# EAGLE schematic 07D-010 (EAGLE 6.3)

## Sheet 1 of 2
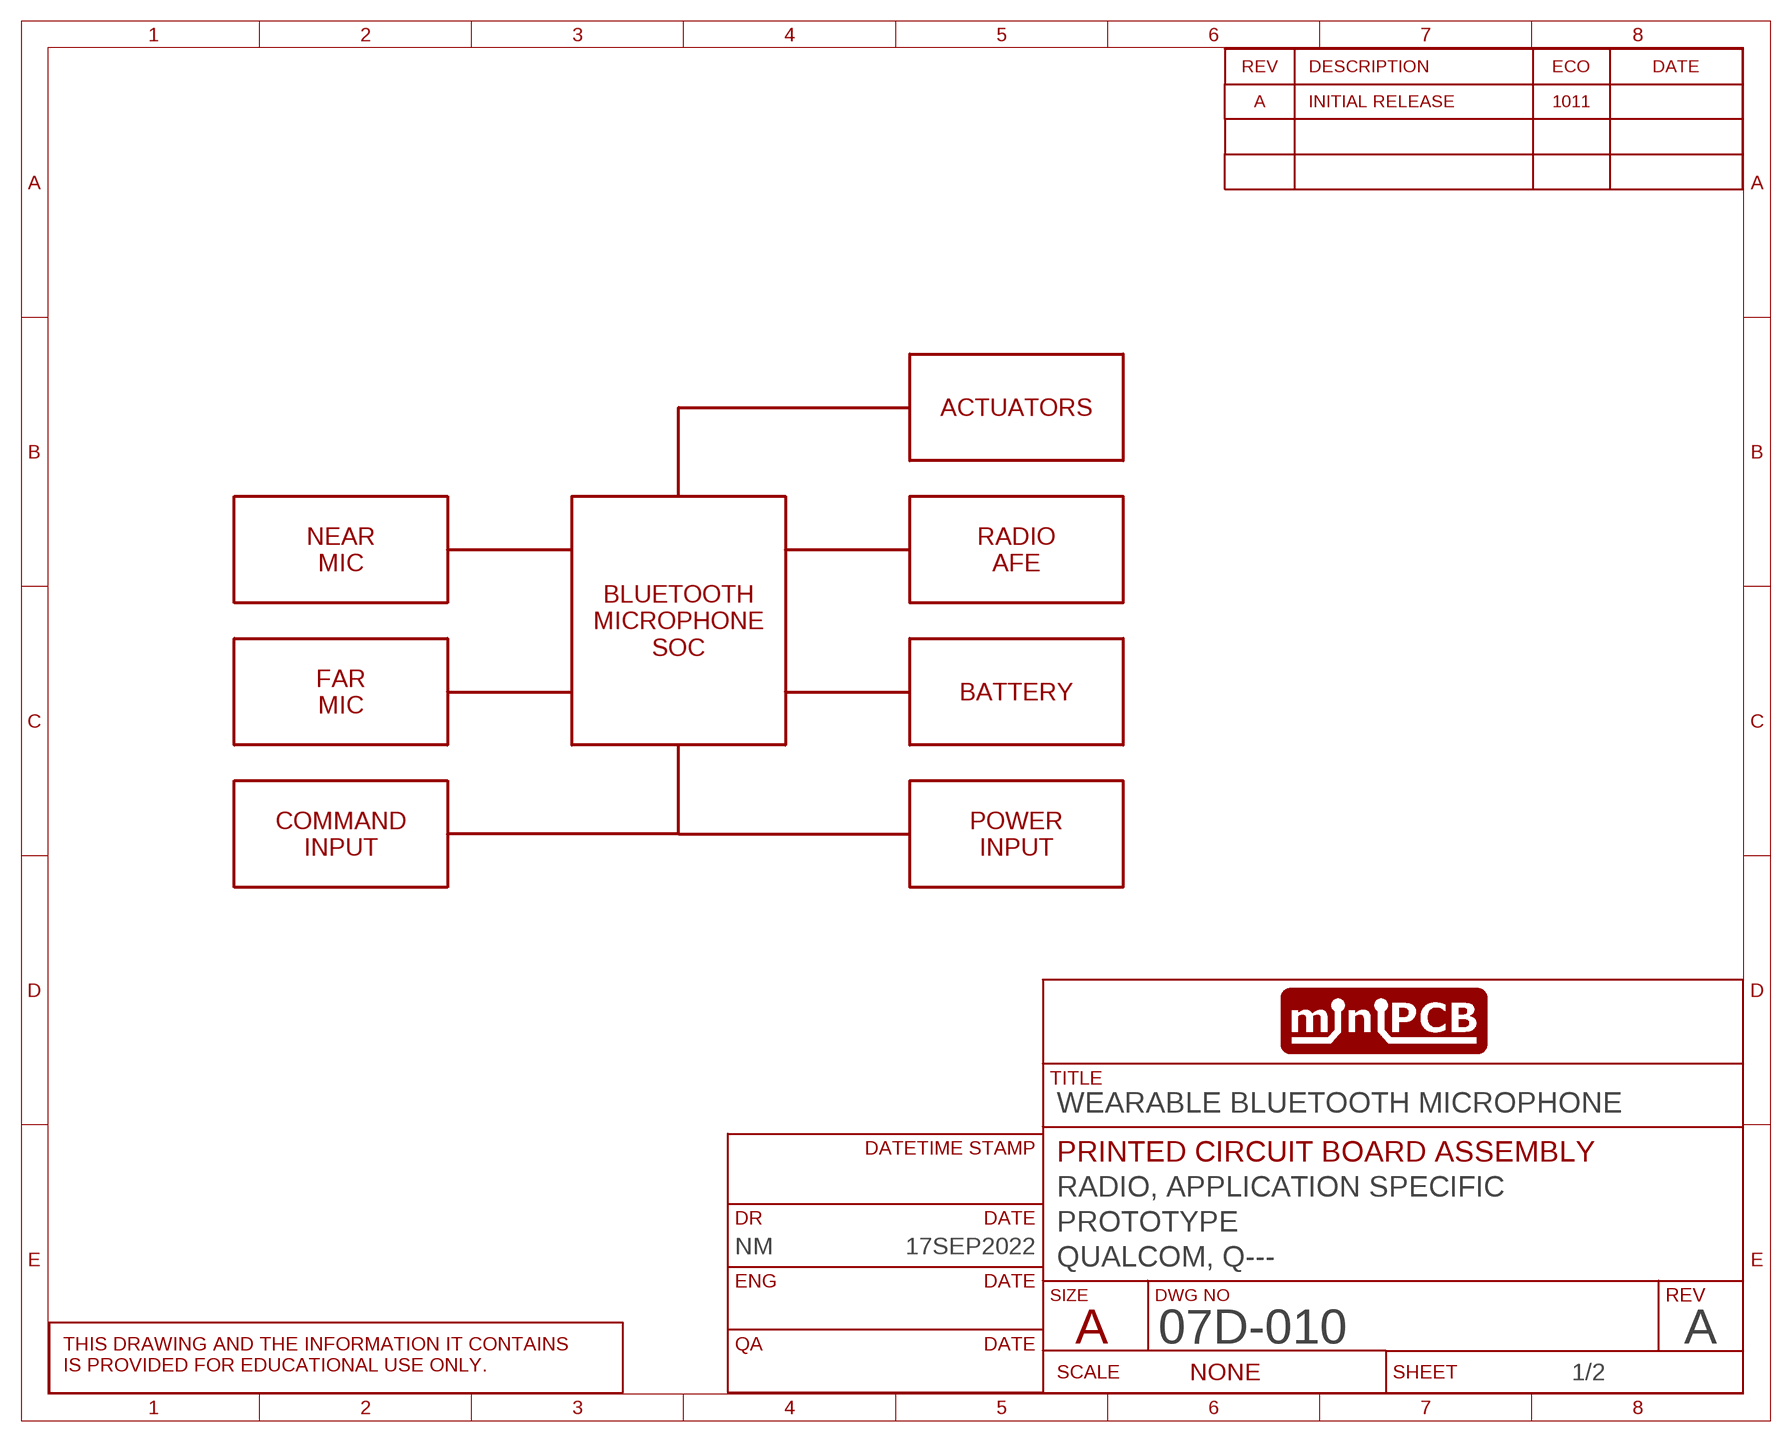
[diagram p0: schematic, sheet 1]
SHEET1 (SCHEMATIC): CIRCUIT_CATEGORY: RADIO, APPLICATION SPECIFIC; CIRCUIT_NAME: PROTOTYPE; CIRCUIT_VARIANT: QUALCOM, Q---; DR: NM; DR_DATE: 17SEP2022; PCB_PCBA: PRINTED CIRCUIT BOARD ASSEMBLY; REVA: A; REVA_ECO: 1011; REVISION: A; TITLE: WEARABLE BLUETOOTH MICROPHONE

### Notes on the sheet
- ACTUATORS
- NEAR
  MIC
- RADIO
  AFE
- BLUETOOTH
  MICROPHONE
  SOC
- FAR
  MIC
- BATTERY
- COMMAND
  INPUT
- POWER
  INPUT

## Sheet 2 of 2
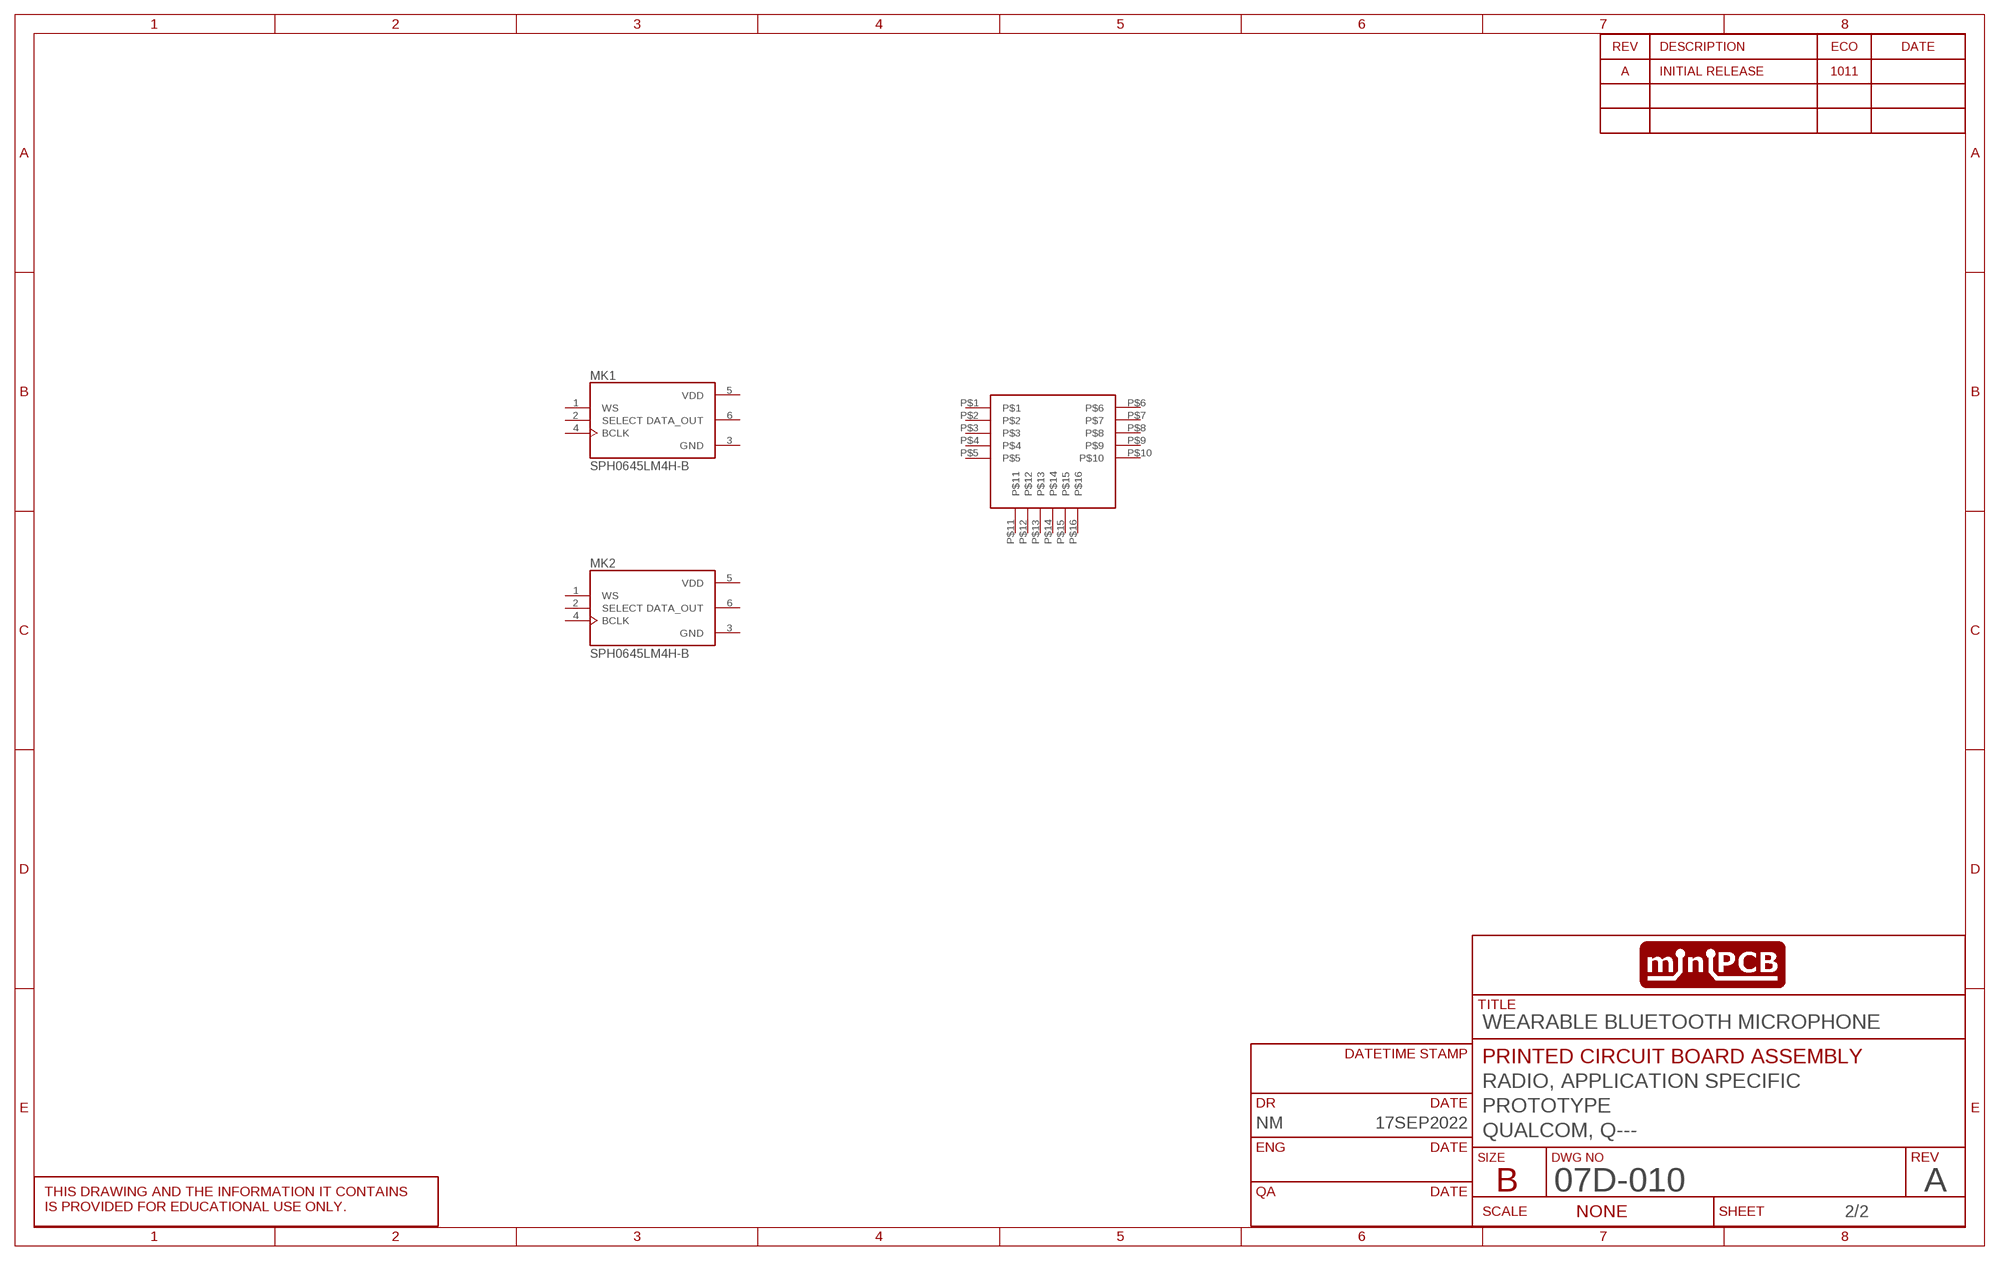
[diagram p1: schematic, sheet 2]

### Parts
MK1  SPH0645LM4H-B  [MIC_SPH0645LM4H-B]
MK2  SPH0645LM4H-B  [MIC_SPH0645LM4H-B]
U$1  BTM525  [PINS_1_20P]
Unconnected: MK1.1(WS) MK1.2(SELECT) MK1.4(BCLK) MK1.6(DATA_OUT) MK2.1(WS) MK2.2(SELECT) MK2.4(BCLK) MK2.6(DATA_OUT) U$1.P$1 U$1.P$2 U$1.P$3 U$1.P$4 U$1.P$5 U$1.P$6 U$1.P$7 U$1.P$8 U$1.P$9 U$1.P$10 U$1.P$11 U$1.P$12 U$1.P$13 U$1.P$14 U$1.P$15 U$1.P$16

## Power pins joined to a net without a drawn wire
GND: MK1.3(GND) MK2.3(GND)
VDD: MK1.5(VDD) MK2.5(VDD)

## Library data of the parts
MK1 MK2 = utsa:SPH0645LM4H-B: Mic Mems Digital I2s Omni -26db; DESCRIPTION: 20 Hz ~ 10 kHz Digital, I²S Microphone MEMS (Silicon) 1.62 V ~ 3.6 V Omnidirectional (-26dB ±3dB @ 94dB SPL) Solder Pads; DIGI-KEY_PART_NUMBER: 423-1405-2-ND; MF: Knowles; MP: SPH0645LM4H-B; PACKAGE: None; PURCHASE-URL: https://pricing.snapeda.com/search/part/SPH0645LM4H-B/?ref=eda
U$1 = minipcb:BTM525